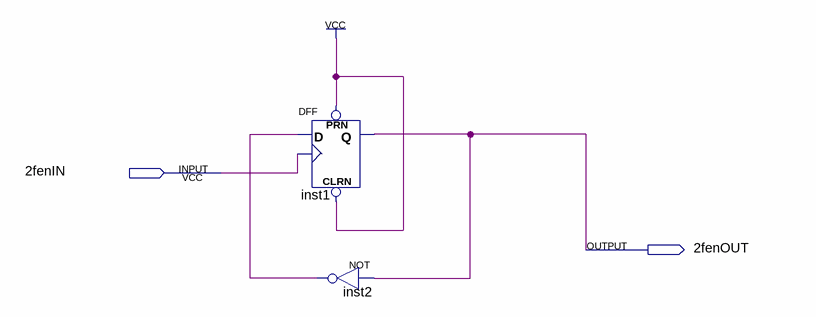
[diagram p0: schematic sheet]
// Quartus schematic 2fenpin.bdf as structural Verilog: 2 symbols, 2 pins
module \2fenpin  (
  input  \2fenIN ,
  output \2fenOUT 
);

  wire inst2_out;

  DFF inst1 (.CLRN(1'b1), .CLK(\2fenIN ), .D(inst2_out), .PRN(1'b1), .Q(\2fenOUT ));
  not inst2 (inst2_out, \2fenOUT );
endmodule
